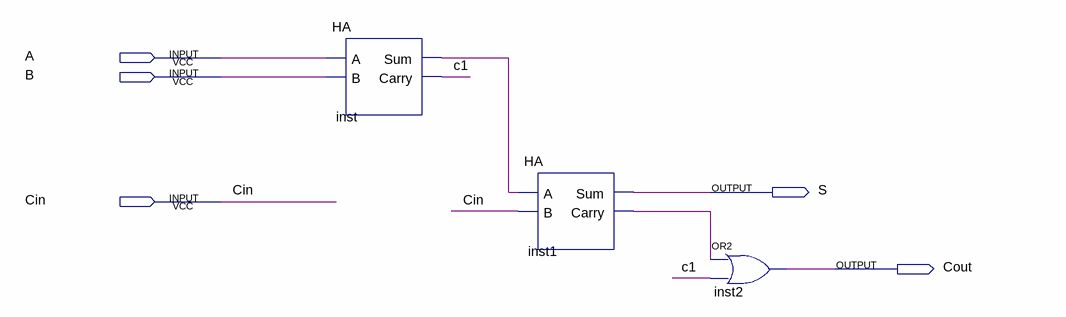
[diagram p0: schematic sheet]
// Quartus schematic FA.bdf as structural Verilog: 3 symbols, 5 pins
module FA (
  input  A,
  input  B,
  input  Cin,
  output S,
  output Cout
);

  wire c1, inst1_carry, inst_sum;

  HA inst (.A(A), .B(B), .Sum(inst_sum), .Carry(c1));
  HA inst1 (.A(inst_sum), .B(Cin), .Sum(S), .Carry(inst1_carry));
  or inst2 (Cout, inst1_carry, c1);
endmodule
